# Altium schematic sheet board.SchDoc
size A4
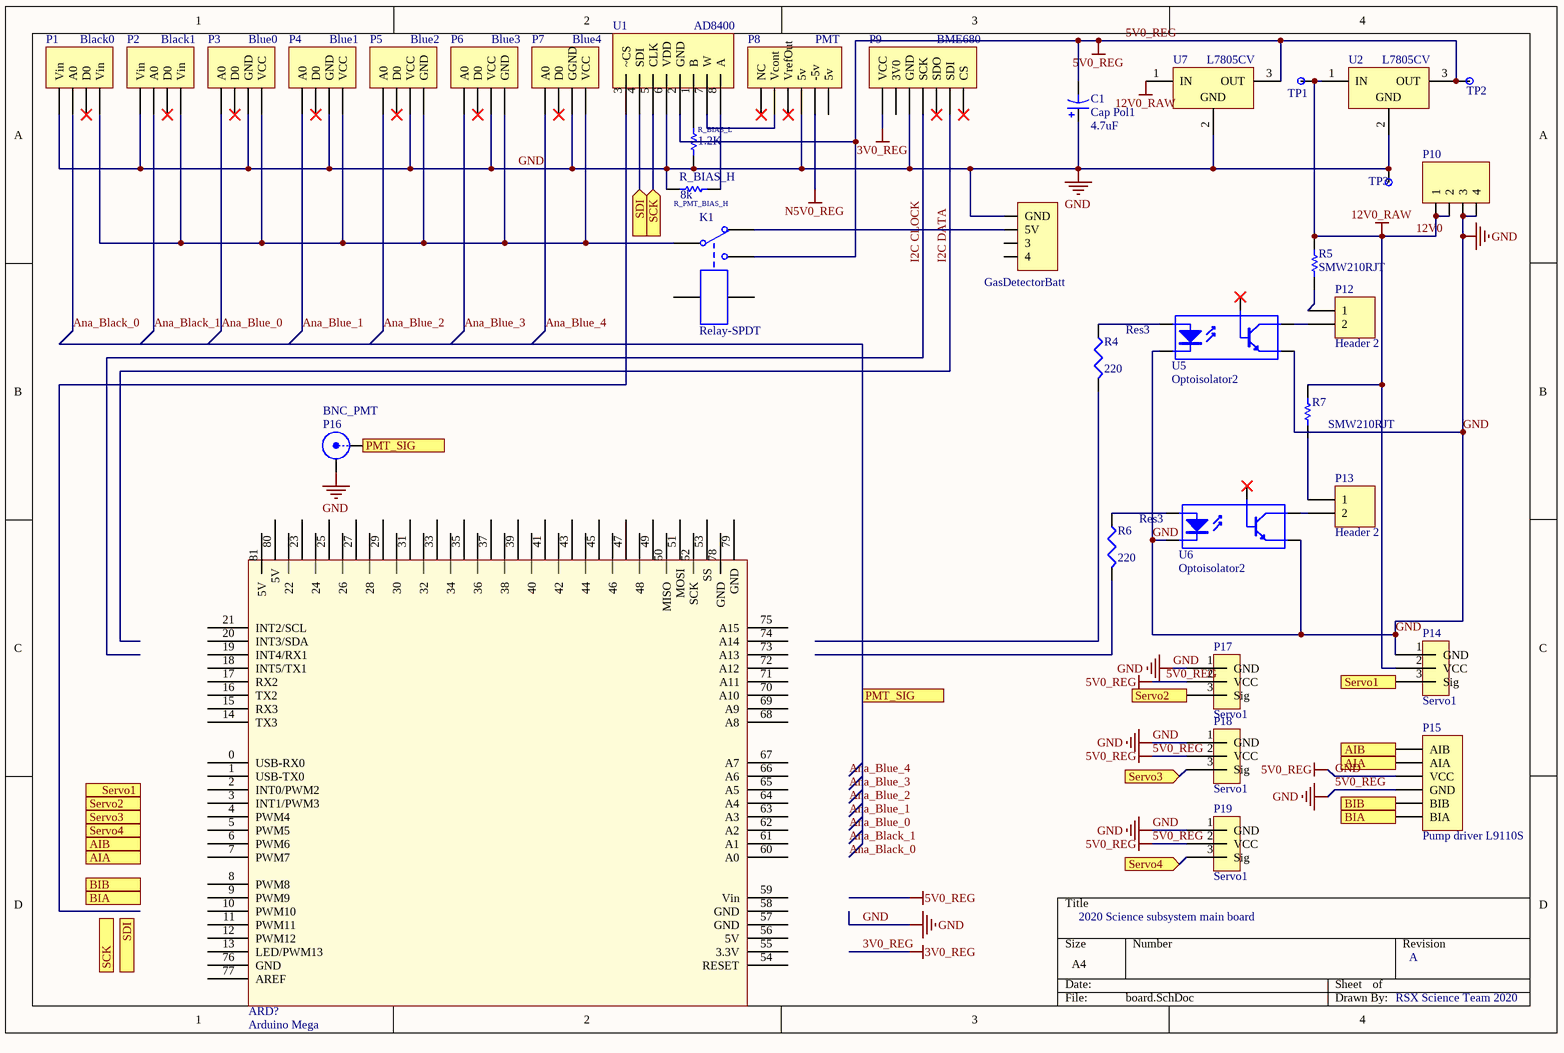
[diagram p0: board.SchDoc]

## Parts
ARD?  Arduino Mega  [Arduino Mega]
C1  Cap Pol1  value 4.7uF  [RB7.6-15]
GasDetectorBatt  Mini-Fit Jr 4 Pos  [MOLEX 0039281043]  (value not drawn)
K1  Relay-SPDT  [MODULE5B]
P1  Black0  [HDR1X4]
P2  Black1  [HDR1X4]
P3  Blue0  [HDR1X4]
P4  Blue1  [HDR1X4]
P5  Blue2  [HDR1X4]
P6  Blue3  [HDR1X4]
P7  Blue4  [HDR1X4]
P8  PMT  [HDR1X6H]
P9  BME680  [HDR1X7]
P10  Mini-Fit Jr 4 Pos  [MOLEX 0039281043]  (value not drawn)
P12  Header 2  [HDR1X2]
P13  Header 2  [HDR1X2]
P14  Servo1  [Header3]
P15  Pump driver L9110S  [HDR1X6]
P16  BNC_PMT  [BNC_RA CON]
P17  Servo1  [Header3]
P18  Servo1  [Header3]
P19  Servo1  [Header3]
R4  Res3  value 220  [RESC1608X06N_0603]
R5  SMW210RJT  [TECO-SMW2-2_V]
R6  Res3  value 220  [RESC1608X06N_0603]
R7  SMW210RJT  [TECO-SMW2-2_V]
R_BIAS_H  R_PMT_BIAS_H  value 8k  [AXIAL-0.3]
R_BIAS_L  1.2K  [AXIAL-0.3]
TP1  12V0_RAW  [50_MIL_PAD]  (value not drawn)
TP2  5V0_REG  [50_MIL_PAD]  (value not drawn)
TP3  GND  [50_MIL_PAD]  (value not drawn)
U1  AD8400  [AD8400(SOIC8)]
U2  L7805CV  [TO220]
U5  Optoisolator2  [SOP5(6)]
U6  Optoisolator2  [SOP5(6)]
U7  L7805CV  [TO220]

## Ports
AIA (in), AIA (out), AIB (in), AIB (out), BIA (in), BIA (out), BIB (in), BIB (out), PMT_SIG (in), PMT_SIG (out), SCK (in), SCK (out), SDI (in), SDI (out), Servo1 (in), Servo1 (out), Servo2 (in), Servo2 (out), Servo3 (in), Servo3 (out), Servo4 (in), Servo4 (out)

## Nets
3V0_REG: P9.1(VCC)
5V0_REG: C1.1 C1.2 GasDetectorBatt.1(GND) K1.3 P1.4(Vin) P2.4(Vin) P3.3(GND) P4.3(GND) P5.4(VCC) P6.4(VCC) P7.3(GGND) P8.6(5v) P9.3(GND) P10.3 P10.4 P14.1(GND) P15.3(VCC) P15.4(GND) P16.2(Y) P17.1(GND) P17.2(VCC) P18.1(GND) P18.2(VCC) P19.1(GND) P19.2(VCC) R_BIAS_H.1 R_BIAS_L.2 TP2.1 TP3.1 U1.2(GND) U1.6(VDD) U2.2(GND) U2.3(OUT) U5.3(K) U5.4(E) U6.3(K) U6.4(E) U7.2(GND) U7.3(OUT)  [also labelled GND]
12V0: P10.1 P10.2 P14.2(VCC) R5.2 R7.2 TP1.1 U2.1(IN) U7.1(IN)  [also labelled 12V0_RAW]
N5V0_REG: P8.5(-5v)
AIA: P15.2(AIA) ; port AIA
AIB: P15.1(AIB) ; port AIB
Ana_Black_0: P1.2(A0)
Ana_Black_1: P2.2(A0)
Ana_Blue_0: P3.1(A0)
Ana_Blue_1: P4.1(A0)
Ana_Blue_2: P5.1(A0)
Ana_Blue_3: P6.1(A0)
Ana_Blue_4: P7.1(A0)
BIA: P15.6(BIA) ; port BIA
BIB: P15.5(BIB) ; port BIB
I2C CLOCK: P9.4(SCK)
I2C DATA: P9.6(SDI)
PMT_SIG: P16.1(X) ; port PMT_SIG
SCK: U1.5(CLK) ; port SCK
SDI: U1.4(SDI) ; port SDI
Servo1: P14.3(Sig) ; port Servo1
Servo2: P17.3(Sig) ; port Servo2
Servo3: P18.3(Sig) ; port Servo3
Servo4: P19.3(Sig) ; port Servo4
NetGasDetectorBatt_2: GasDetectorBatt.2(5V) K1.2
NetK1_1: K1.1 P1.4(Vin) P2.4(Vin) P3.4(VCC) P4.4(VCC) P5.3(GND) P6.4(GND) P7.4(VCC)
NetP8_2: P8.2(Vcont) U1.7(W)
NetP12_1: P12.1 R5.1
NetP12_2: P12.2 U5.5(C)
NetP13_1: P13.1 R7.1
NetP13_2: P13.2 U6.5(C)
NetR4_1: R4.1 U5.1(A)
NetR6_1: R6.1 U6.1(A)
NetR_BIAS_H_2: R_BIAS_H.2 U1.8(A)
NetR_BIAS_L_1: R_BIAS_L.1 U1.1(B)

Not connected (* = marked no-connect by the designer): ARD? 0(USB-RX0) 1(USB-TX0) 2(INT0/PWM2) 3(INT1/PWM3) 4(PWM4) 5(PWM5) 6(PWM6) 7(PWM7) 8(PWM8) 9(PWM9) 10(PWM10) 11(PWM11) 12(PWM12) 13(LED/PWM13) 14(TX3) 15(RX3) 16(TX2) 17(RX2) 18(INT5/TX1) 19(INT4/RX1) 20(INT3/SDA) 21(INT2/SCL) 22 23 24 25 26 27 28 29 30 31 32 33 34 35 36 37 38 39 40 41 42 43 44 45 46 47 48 49 50(MISO) 51(MOSI) 52(SCK) 53(SS) 54(RESET) 55(3.3V) 56(5V) 57(GND) 58(GND) 59(Vin) 60(A0) 61(A1) 62(A2) 63(A3) 64(A4) 65(A5) 66(A6) 67(A7) 68(A8) 69(A9) 70(A10) 71(A11) 72(A12) 73(A13) 74(A14) 75(A15) 76(GND) 77(AREF) 78(GND) 79(GND) 80(5V) 81(5V); GasDetectorBatt 3 4; K1 4 5; P1 3(D0)*; P2 3(D0)*; P3 2(D0)*; P4 2(D0)*; P5 2(D0)*; P6 2(D0)*; P7 2(D0)*; P8 1(NC)* 3(VrefOut)*; P9 2(3V0) 5(SDO)* 7(CS)*; R4 2; R6 2; U1 3(~CS); U5 6(B)*; U6 6(B)*

## Notes on the sheet
- 2020 Science subsystem main board
- A
- RSX Science Team 2020
- Labels drawn without touching a wire or pin: Ana_Black_0, Ana_Black_1, Ana_Blue_0, Ana_Blue_1, Ana_Blue_2, Ana_Blue_3, Ana_Blue_4

## Library data of the parts
C1 = Cap Pol1: Polarized Capacitor (Radial); Published: 8-Jun-2000; LatestRevisionDate: 17-Jul-2002; LatestRevisionNote: Re-released for DXP Platform.; PackageReference: RB7.6-15; Publisher: Altium Limited; PackageDescription: Polarized Capacitor (Radial); 2 Leads
GasDetectorBatt P10 = Molex 0039281043: Mini-Fit Jr. Header, Dual Row, Right-Angle, with Snap-in Plastic Peg PCB Lock, 6 Circuits, PA Polyamide Nylon 6/6 94V-2, 0.76µm Select Gold (Au) Plating
K1 = Relay-SPDT: Single-Pole Dual-Throw Relay; Published: 24-Mar-1999; LatestRevisionDate: 17-Jul-2002; LatestRevisionNote: Re-released for DXP Platform.; PackageReference: MODULE5B; Publisher: Altium Limited
P1-P7 = Header 4: Header, 4-Pin; LatestRevisionDate: 17-Jul-2002; LatestRevisionNote: Re-released for DXP Platform.; Publisher: Altium Limited
P8 = Header 6H: Header, 6-Pin, Right Angle; LatestRevisionDate: 17-Jul-2002; LatestRevisionNote: Re-released for DXP Platform.; Publisher: Altium Limited
P9 = Header 7: Header, 7-Pin; LatestRevisionDate: 17-Jul-2002; LatestRevisionNote: Re-released for DXP Platform.; Publisher: Altium Limited
P12 P13 = Header 2: Header, 2-Pin; LatestRevisionDate: 17-Jul-2002; LatestRevisionNote: Re-released for DXP Platform.; Publisher: Altium Limited
P14 P17-P19 = Header3
P15 = Header 6: Header, 6-Pin; LatestRevisionDate: 17-Jul-2002; LatestRevisionNote: Re-released for DXP Platform.; Publisher: Altium Limited
P16 = BNC: BNC Elbow Connector; LatestRevisionDate: 17-Jul-2002; LatestRevisionNote: Re-released for DXP Platform.; Publisher: Altium Limited
R4 R6 = Res3: Resistor; Published: 8-Jun-2000; LatestRevisionDate: 29-May-2009; LatestRevisionNote: IPC-7351 Footprint Added.; PackageReference: J1-0603; Publisher: Altium Limited; PackageDescription: Chip Resistor
R5 R7 = CMP-0880-00001-1: Moulded Power Resistor, 2 W, 10 Ohm +/- 5%, 2-Pin 6.7 x 4 x 3.85 mm SMD, RoHS, Tape and Reel; Manufacturer: TE Connectivity; Tolerance: +/- 5%; Temperature Coefficient of Resistance: +/- 200 ppm/degC; Max Operating Voltage: 300 V; Resistance Value: 10 Ohm; ComponentLink1Description: Manufacturer URL; Case Size: 2 W; RoHS: TRUE; ComponentLink1URL: http://www.te.com/; Packing: Tape and Reel; Mounting Technology: Surface Mount; PackageReference: SMW2-2; ComponentLink2Description: Datasheet; PackageDescription: 2-Pin SMD, Body 6.7 x 4 mm, Height 3.85 mm; PartNumber: SMW210RJT; ComponentLink2URL: http://www.te.com/commerce/DocumentDelivery/DDEController?Action=showdoc&DocId=Data+Sheet%7F1773242%7FE%7Fpdf%7FEnglish%7FENG_DS_1773242_E.pdf%7F4-1676966-9; DatasheetVersion: Apr-12
R_BIAS_H R_BIAS_L = Res1: Resistor; Published: 8-Jun-2000; LatestRevisionDate: 17-Jul-2002; LatestRevisionNote: Re-released for DXP Platform.; PackageReference: AXIAL-0.3; Publisher: Altium Limited; PackageDescription: Axial Device, Thru-Hole; 2 Leads; 0.3 in Pin Spacing
TP1-TP3 = TestPt
U1 = Component_1
U2 U7 = CMP-0244-00483-1: Positive Voltage Regulator, 5V, 3-Pin TO-220; PackageDescription: TO, Thru-Hole, Vertical, Heatsink Mounted; 3 In-Line Leads; Pitch 2.54 mm; ComponentLink2Description: Datasheet; PackageReference: TO220; ComponentLink3URL: http://www.st.com/internet/com/TECHNICAL_RESOURCES/TECHNICAL_LITERATURE/PACKAGE_INFORMATION/CD00004649.pdf; DatasheetVersion: 16/11/2011; ComponentLink1Description: Manufacturer URL; ComponentLink1URL: http://www.st.com; PackageVersion: ver3.0; ComponentLink3Description: Package Specification; ComponentLink2URL: http://www.st.com/internet/com/TECHNICAL_RESOURCES/TECHNICAL_LITERATURE/DATASHEET/CD00000444.pdf
U5 U6 = Optoisolator2: 5 Pin Mini Flat Pack Optocoupler; Published: 24-Mar-1999; LatestRevisionDate: 04-Mar-2005; LatestRevisionNote: PCB Footprint replaced, Sch pins re-numbered.; DatasheetVersion: Apr-2004; PackageReference: SOP5(6); Publisher: Altium Limited; PackageDescription: Small Outline; 6 Leads (1 Absent); Body Width 4.4 mm; Pitch 1.27 mm